# EAGLE design Projeto Final (EAGLE 9.1.2)
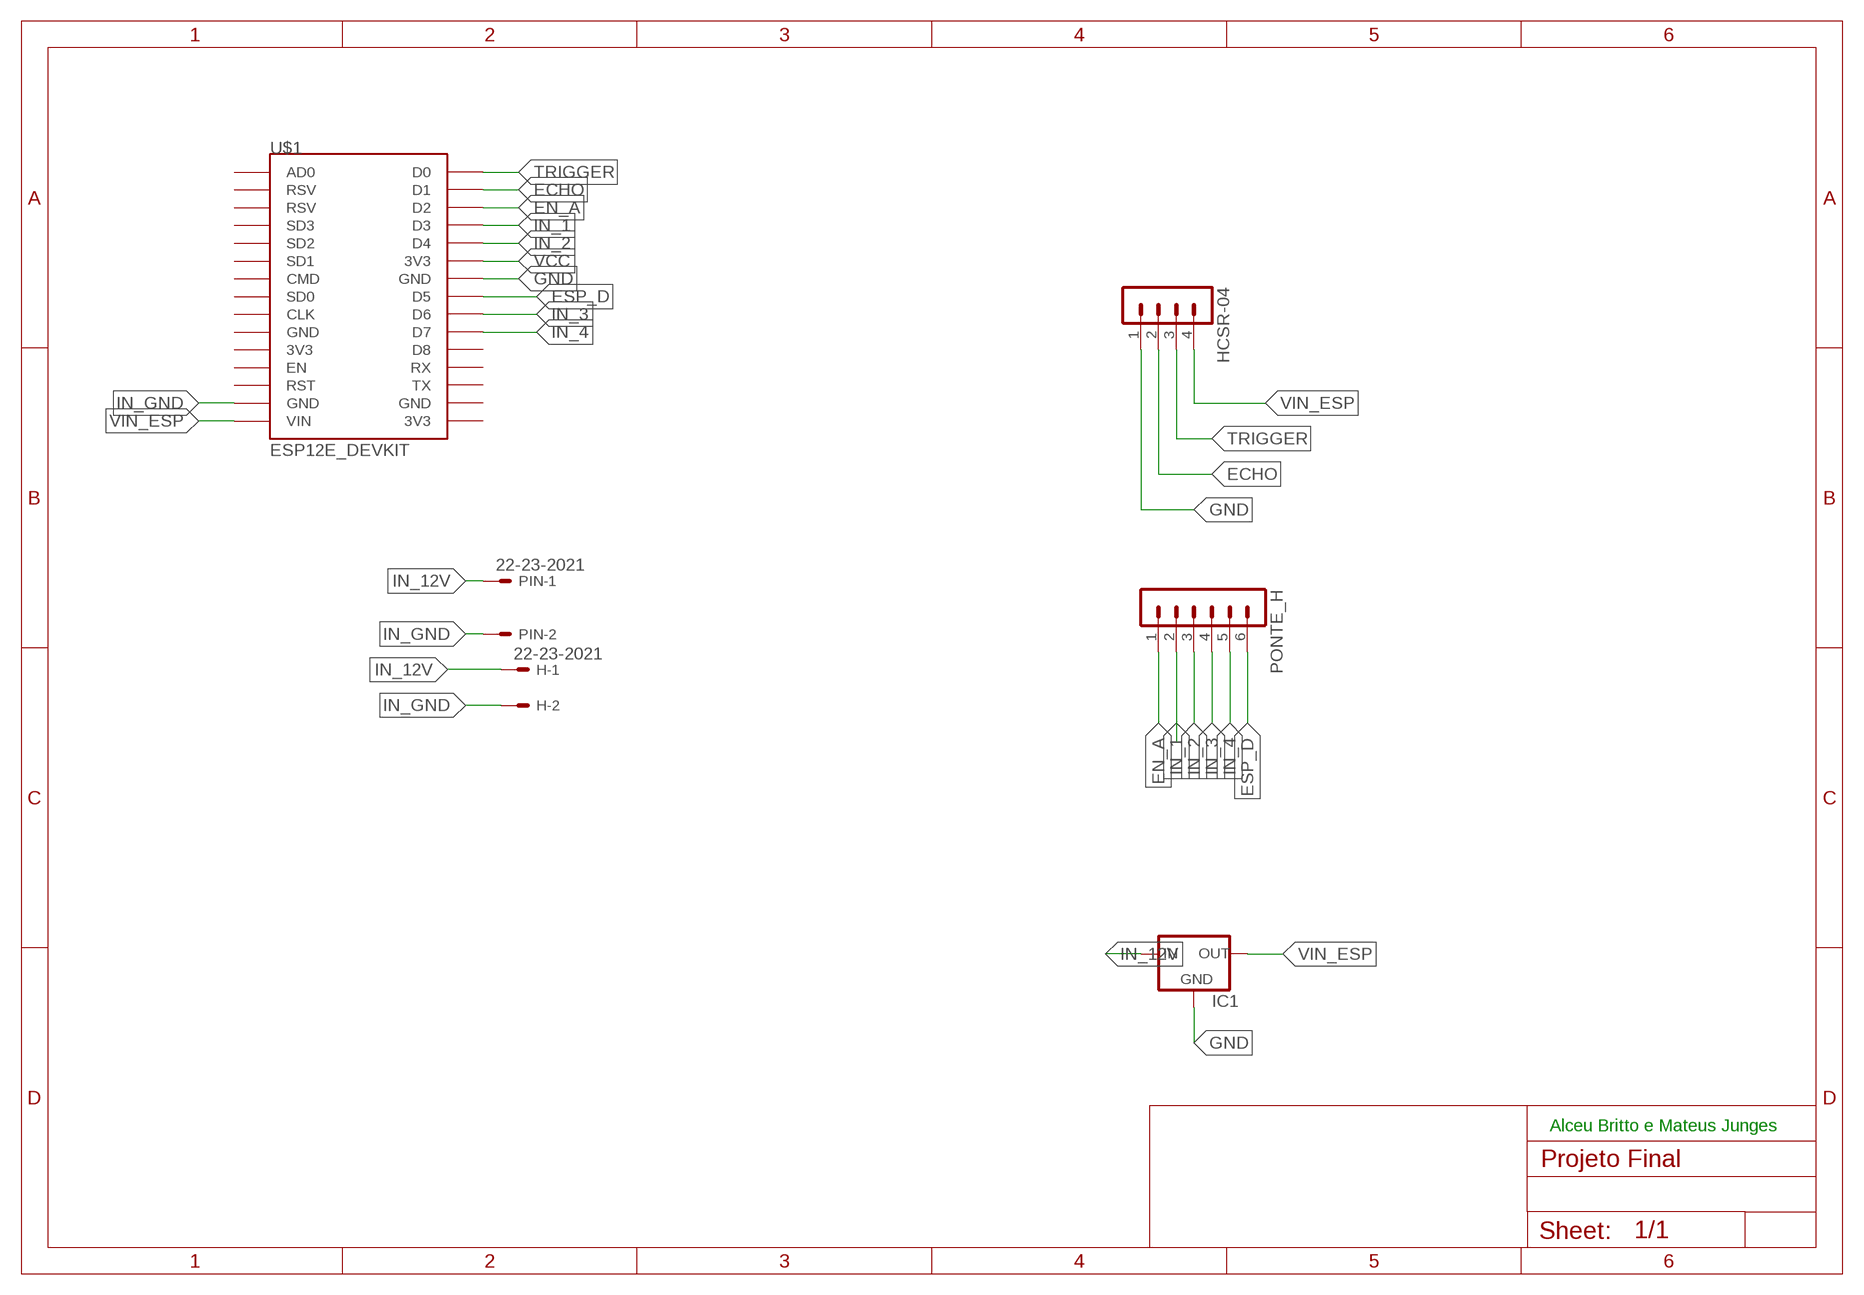
[diagram p0: schematic, sheet 1]

## Parts
H  22-23-2021  [22-23-2021]
HCSR-04  MA04-1  [MA04-1]
IC1  78XXL  [78XXL]
PIN  22-23-2021  [22-23-2021]
PONTE_H  MA06-1  [MA06-1]
U$1  ESP12E_DEVKIT  [ESP12E_DEVKIT]

## Nets
ECHO: HCSR-04.2 U$1.D1
EN_A: PONTE_H.1 U$1.D2
ESP_D: PONTE_H.6 U$1.D5
GND [GND]: HCSR-04.1 IC1.GND U$1.GND@2(GND)
IN_1: PONTE_H.2 U$1.D3
IN_2: PONTE_H.3 U$1.D4
IN_3: PONTE_H.4 U$1.D6
IN_4: PONTE_H.5 U$1.D7
IN_12V: H.1 IC1.IN PIN.1
IN_GND: H.2 PIN.2 U$1.GND@1(GND)
TRIGGER: HCSR-04.3 U$1.D0
VCC [VCC]: U$1.3V3@1(3V3)
VIN_ESP: HCSR-04.4 IC1.OUT U$1.VIN
Unconnected: U$1.3V3@0(3V3) U$1.3V3@2(3V3) U$1.AD0 U$1.CLK U$1.CMD U$1.D8 U$1.EN U$1.GND@0(GND) U$1.GND@3(GND) U$1.RST U$1.RSV@0(RSV) U$1.RSV@1(RSV) U$1.RX U$1.SD0 U$1.SD1 U$1.SD2 U$1.SD3 U$1.TX

## Notes on the sheet
- Alceu Britto e Mateus Junges

## Library data of the parts
H PIN = con-molex:22-23-2021: .100" (2.54mm) Center Header - 2 Pin; MF: MOLEX; MPN: 22-23-2021; OC_FARNELL: 1462926; OC_NEWARK: 25C3832
HCSR-04 = con-lstb:MA04-1: PIN HEADER; OC_FARNELL: unknown; OC_NEWARK: unknown
IC1 = v-reg:78XXL: VOLTAGE REGULATOR
PONTE_H = con-lstb:MA06-1: PIN HEADER; OC_FARNELL: unknown; OC_NEWARK: unknown
U$1 = ESP12E_DEVKIT:ESP12E_DEVKIT: ESP12E DEVKIT BOARD

## Net classes
0 default: width 1 mm
1 VCC: width 2 mm
2 GND: width 2 mm

## Board
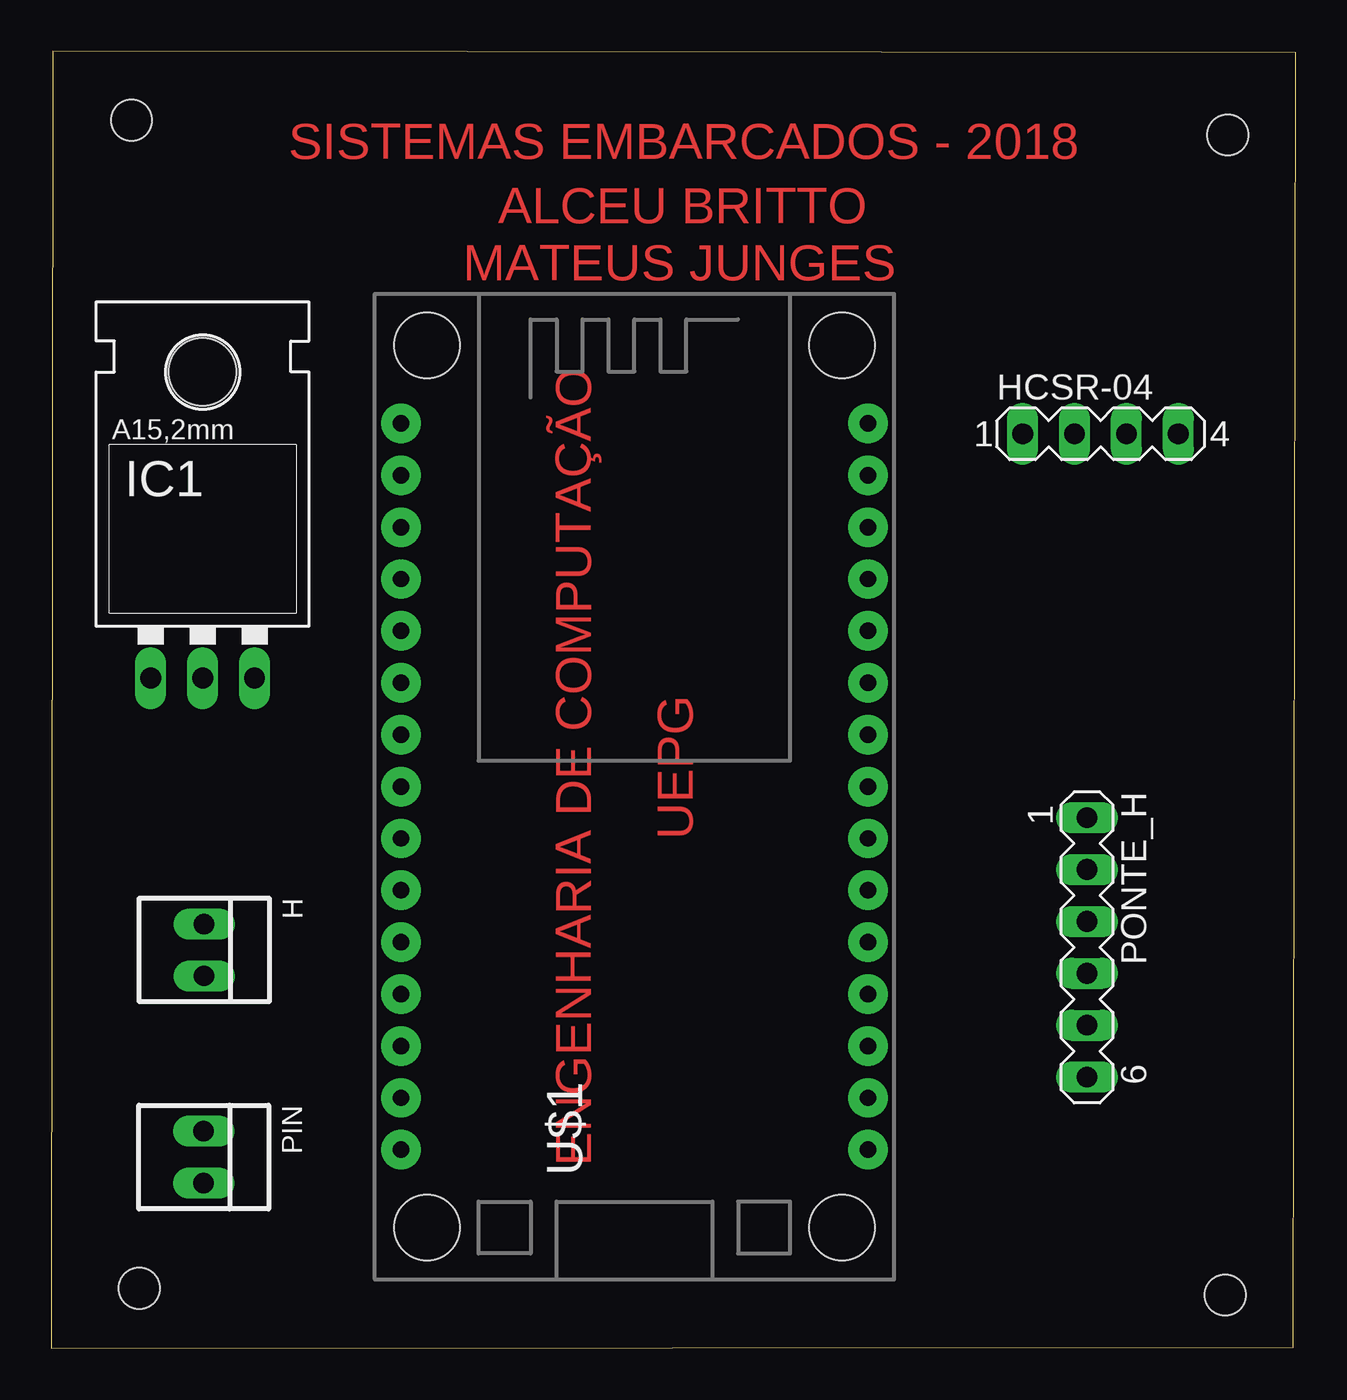
[diagram p1: board, top side]
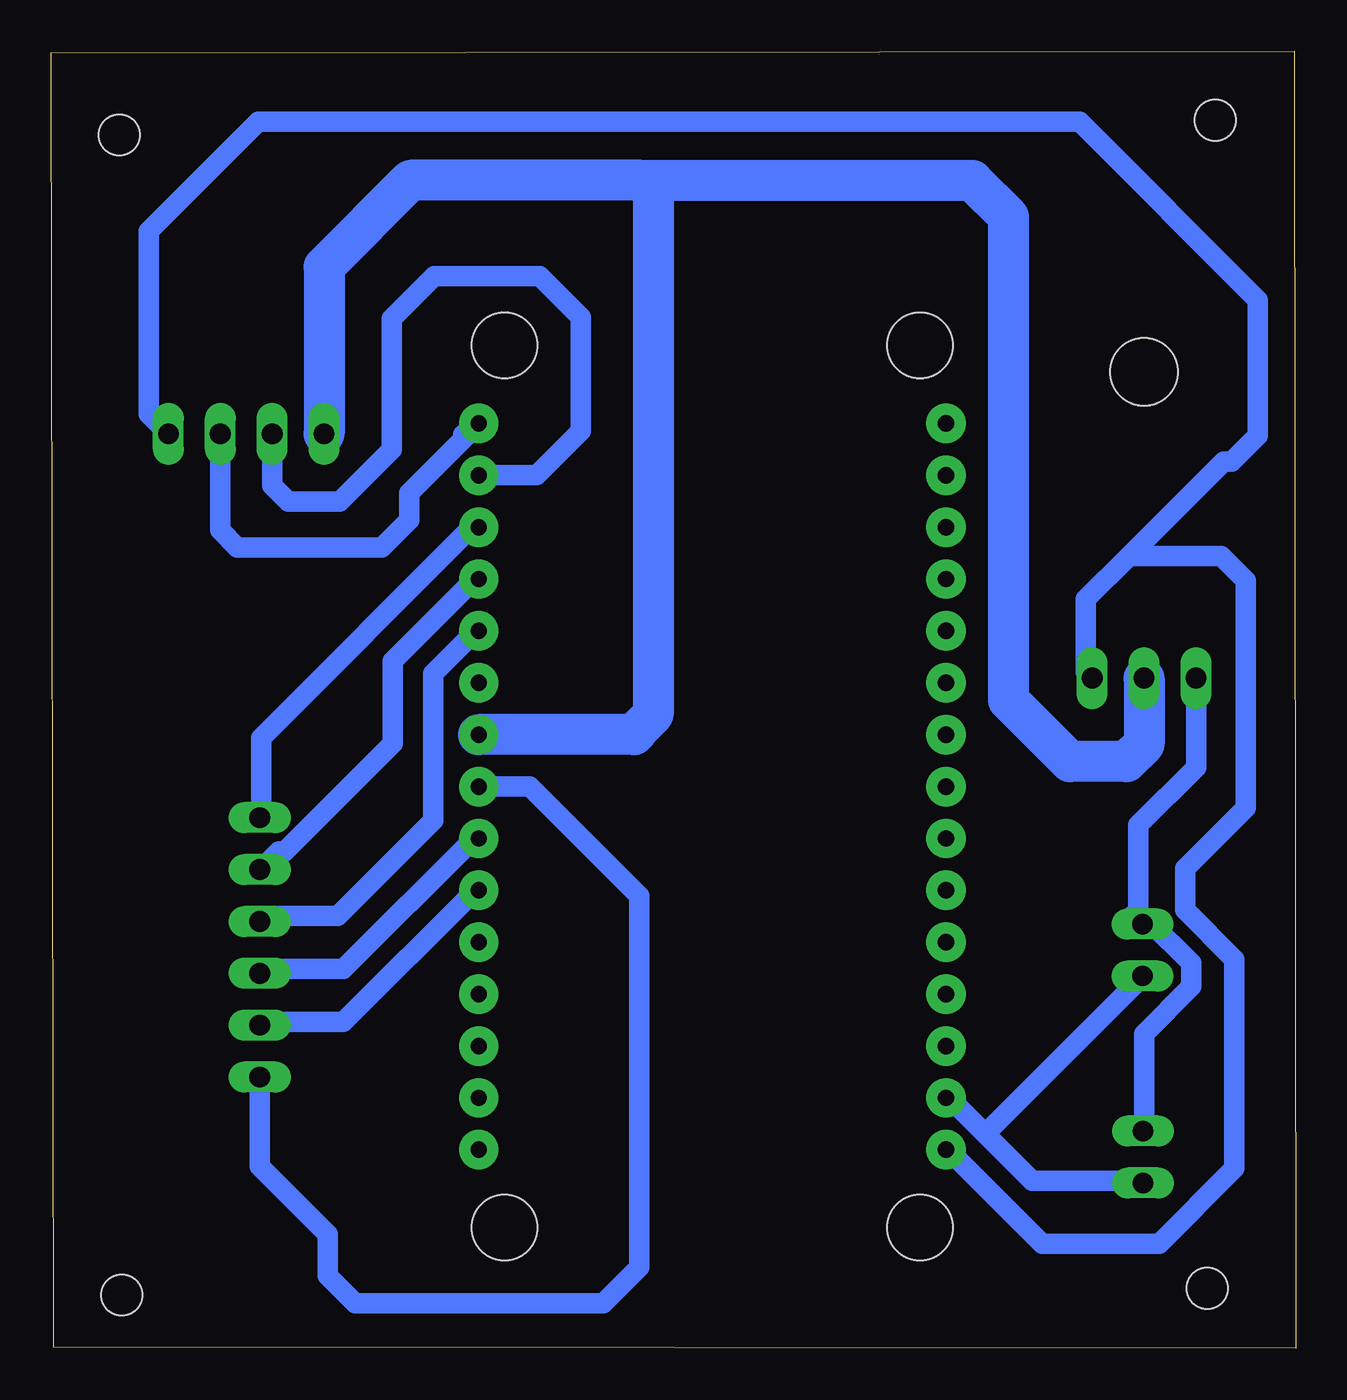
[diagram p2: board, bottom side, seen from below]

Size 60.91 x 63.52 mm. Coordinates in mm from the lower left corner, seen from the top.
Outline: 0,0 60.78,0.05 60.91,63.44 0.08,63.52 0,0
Copper layers (1*16): Top 0.035mm / dielectric 1.5mm / Bottom 0.035mm
Design rules "default": minimum track width 6mil, minimum drill 0.35mm, track to track 6mil, track to pad 6mil, pad to pad 6mil, via to via 6mil, smd to smd 6mil, copper to edge 40mil, drill to drill 6mil, minimum pad ring 10mil, minimum via ring 8mil, stop-mask expansion 4mil, vias tented up to drill 0mil, thermal gap 10mil
Holes 2 mm at 3.94,60.12 57.58,59.41 57.45,2.62 4.32,2.95

### Footprints (pad centres in the part's own frame; a part is rotated, then mirrored left to right if it is on the bottom)
22-23-2021 = drill 1 long: 1 -1.27,0; 2 1.27,0
MA04-1 = drill 1.016 long: 1 -3.81,0; 2 -1.27,0; 3 1.27,0; 4 3.81,0
78XXL = drill 1.016 long: GND 0,-3.81; IN -2.54,-3.81; OUT 2.54,-3.81 | hole 3.302: 0,11.176
MA06-1 = drill 1.016 long: 1 -6.35,0; 2 -3.81,0; 3 -1.27,0; 4 1.27,0; 5 3.81,0; 6 6.35,0
ESP12E_DEVKIT = drill 0.8 pad 1.93: 3V3@0 -11.43,-7.62; 3V3@1 11.43,5.08; 3V3@2 11.43,-17.78; AD0 -11.43,17.78; CLK -11.43,-2.54; CMD -11.43,2.54; D0 11.43,17.78; D1 11.43,15.24; D2 11.43,12.7; D3 11.43,10.16; D4 11.43,7.62; D5 11.43,0; D6 11.43,-2.54; D7 11.43,-5.08; D8 11.43,-7.62; EN -11.43,-10.16; GND@0 -11.43,-5.08; GND@1 -11.43,-15.24; GND@2 11.43,2.54; GND@3 11.43,-15.24; RST -11.43,-12.7; RSV@0 -11.43,15.24; RSV@1 -11.43,12.7; RX 11.43,-10.16; SD0 -11.43,0; SD1 -11.43,5.08; SD2 -11.43,7.62; SD3 -11.43,10.16; TX 11.43,-12.7; VIN -11.43,-17.78 | hole 3.2: -10.16,21.59; 10.16,21.59; 10.16,-21.59; -10.16,-21.59

### Placement (x,y rotation side)
H  7.49,19.51 270 top
HCSR-04  51.36,44.78 0 top
IC1  7.42,36.63 0 top
PIN  7.47,9.37 270 top
PONTE_H  50.7,19.63 270 top
U$1  28.55,27.51 0 top

### Tracks (layer width: path | path; a pad name or v marks a point on that pad's centre or on a via)
ECHO
  Bottom 1: U$1.D1 37.14,42.75 34.98,44.91 34.98,50.49 36.98,52.5 42.16,52.5 44.25,50.42 44.25,43.99 45.06,43.18 46.79,41.45 49.3,41.45 50.09,42.24 HCSR-04.2
EN_A
  Bottom 1: PONTE_H.1 50.63,26.07 50.63,29.89 40.34,40.18 U$1.D2
ESP_D
  Bottom 1: U$1.D5 37.49,27.51 32.13,22.15 32.13,3.96 33.88,2.21 46.03,2.21 47.38,3.56 47.38,5.59 50.7,8.91 PONTE_H.6
GND
  Bottom 2: 32.03,57.18 31.45,56.59 31.45,31.04 32.26,30.23 32.26,30.17 32.39,30.05 U$1.GND@2 | 32.03,57.18 15.82,57.18 14.05,55.4 14.05,31.72 11.05,28.73 8.28,28.73 7.42,29.59 IC1.GND | HCSR-04.1 47.55,52.96 43.32,57.18 32.04,57.18 32.03,57.18
IN_1
  Bottom 1: PONTE_H.2 50.63,23.47 49.77,24.34 49.48,24.34 44.2,29.62 44.2,33.65 40.26,37.59 U$1.D3
IN_2
  Bottom 1: PONTE_H.3 50.63,21.17 46.89,21.17 42.21,25.85 42.21,33.05 40.26,35 U$1.D4
IN_3
  Bottom 1: PONTE_H.4 50.63,18.58 46.6,18.58 40.26,24.92 U$1.D6
IN_4
  Bottom 1: PONTE_H.5 50.63,15.98 46.6,15.98 40.26,22.32 U$1.D7
IN_12V
  Bottom 1: 7.71,20.88 7.99,21.17 | 7.71,20.88 H.1 7.13,20.88 5.11,18.87 5.11,17.71 7.42,15.41 7.42,10.8 PIN.1 | IC1.IN 4.88,28.45 7.71,25.62 7.71,20.88
IN_GND
  Bottom 1: 15.2,10.51 16.93,12.24 U$1.GND@1 | 15.2,10.51 12.89,8.21 7.71,8.21 PIN.2 | 15.2,10.51 7.71,18 H.2
TRIGGER
  Bottom 1: 40.73,44.74 U$1.D0 43.38,41.88 43.38,40.56 44.73,39.22 51.79,39.22 52.63,40.06 HCSR-04.3
VIN_ESP
  Bottom 1: U$1.VIN 16.93,9.65 12.41,5.13 6.67,5.13 3,8.81 3,19.05 5.4,21.46 5.4,23.5 2.44,26.47 2.44,37.59 3.63,38.79 8.15,38.79 | HCSR-04.4 56.13,45.75 56.13,54.69 50.77,60.05 10.57,60.05 1.85,51.33 1.85,44.68 3.12,43.41 3.53,43.41 8.15,38.79 | 8.15,38.79 10.26,36.68 10.26,33.12 IC1.OUT

### Text on the board
Top: SISTEMAS EMBARCADOS - 2018 | ALCEU BRITTO | MATEUS JUNGES | UEPG | ENGENHARIA DE COMPUTAÇÃO